# EAGLE design MBUSadapter (EAGLE 7.2.0)
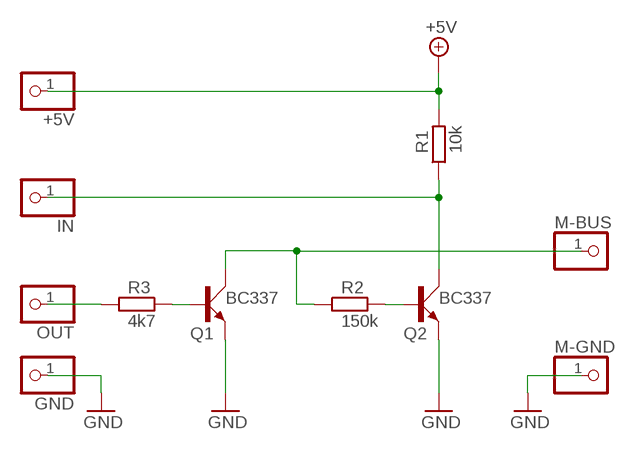
[diagram p0: schematic, sheet 1]

## Parts
+5V  PINHD-1X1  [1X01]
GND  PINHD-1X1  [1X01]
IN  PINHD-1X1  [1X01]
M-BUS  PINHD-1X1  [1X01]
M-GND  PINHD-1X1  [1X01]
OUT  PINHD-1X1  [1X01]
Q1  BC337  [SOT54A]
Q2  BC337  [SOT54A]
R1  10k  R-EU_0207/10  [0207/10]
R2  150k  R-EU_0207/10  [0207/10]
R3  4k7  R-EU_0207/10  [0207/10]

## Nets
+5V: +5V.1 R1.2
GND: GND.1 M-GND.1 Q1.E Q2.E
N$1: IN.1 Q2.C R1.1
N$2: Q1.B R3.1
N$3: OUT.1 R3.2
N$4: M-BUS.1 Q1.C R2.1
N$6: Q2.B R2.2

## Library data of the parts
+5V GND IN M-BUS M-GND OUT = pinhead:PINHD-1X1: PIN HEADER
Q1 Q2 = transistor-small-signal:BC337: NPN TRANSISTOR
R1-R3 = rcl:R-EU_: RESISTOR, European symbol

## Board
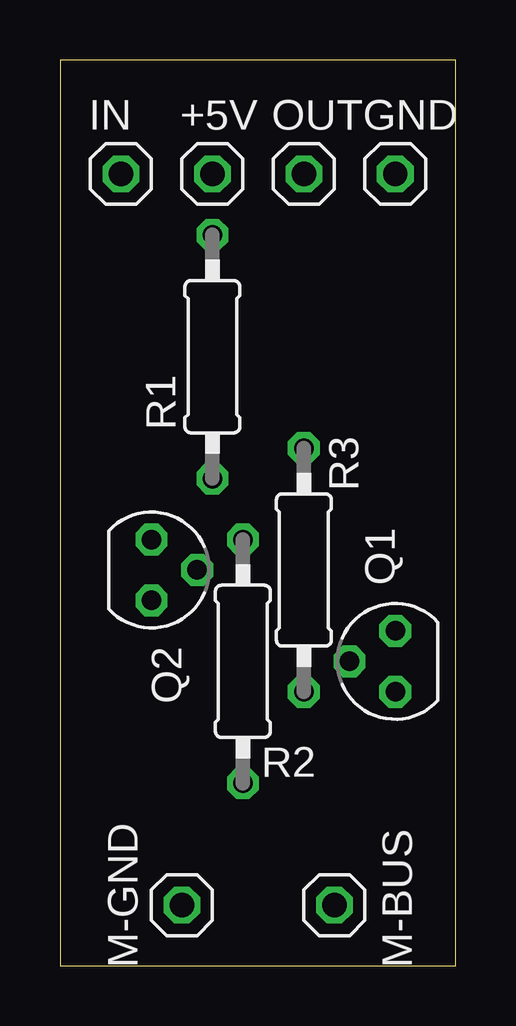
[diagram p1: board, top side]
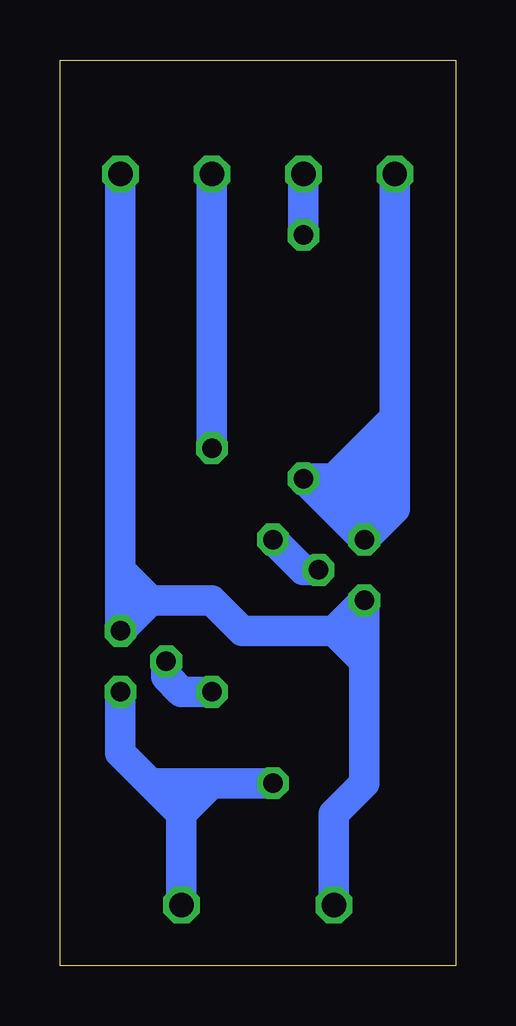
[diagram p2: board, bottom side, seen from below]

Size 16.49 x 37.77 mm. Coordinates in mm from the lower left corner, seen from the top.
Outline: 0,0 16.49,0 16.49,37.77 0,37.77 0,0
Copper layers (1*16): Top 0.035mm / dielectric 1.5mm / Bottom 0.035mm
Design rules "default": minimum track width 10mil, minimum drill 24mil, track to track 8mil, track to pad 8mil, pad to pad 8mil, via to via 8mil, smd to smd 8mil, copper to edge 40mil, drill to drill 8mil, minimum pad ring 10mil, minimum via ring 8mil, stop-mask expansion 4mil, vias tented up to drill 0mil, thermal gap 10mil

### Footprints (pad centres in the part's own frame; a part is rotated, then mirrored left to right if it is on the bottom)
1X01 = drill 1.016 octagon: 1 0,0
SOT54A = drill 0.813 octagon: B 0,1.905; C -1.27,0; E 1.27,0
0207/10 = drill 0.813 octagon: 1 -5.08,0; 2 5.08,0

### Placement (x,y rotation side)
+5V  6.35,33.02 0 top
GND  13.97,33.02 0 top
IN  2.54,33.02 0 top
M-BUS  11.43,2.54 0 top
M-GND  5.08,2.54 0 top
OUT  10.16,33.02 0 top
Q1  13.97,12.7 90 top
Q2  3.81,16.51 270 top
R1  6.35,25.4 90 top
R2  7.62,12.7 90 top
R3  10.16,16.51 90 top

### Tracks (layer width: path | path; a pad name or v marks a point on that pad's centre or on a via)
+5V
  Bottom 1.27: +5V.1 R1.2
GND
  Bottom 1.27: 12.7,15.24 Q1.E 13.97,16.51 | 5.08,13.97 8.89,13.97 10.16,15.24 12.7,15.24 | 5.08,13.97 Q2.E 3.81,12.7 | 3.81,12.7 3.81,7.62 5.08,6.35 M-GND.1 | 13.97,16.51 GND.1 | 12.7,15.24 13.97,16.51 | 5.08,13.97 3.81,12.7
N$1
  Bottom 1.27: 5.08,19.05 Q2.C 2.54,19.05 2.54,20.32 | 5.08,19.05 R1.1 5.08,20.32 2.54,22.86 | IN.1 2.54,22.86 | 2.54,20.32 2.54,21.59 | 2.54,22.86 2.54,21.59 | 2.54,21.59 5.08,19.05 | 5.08,19.05 3.81,19.05 2.54,20.32
N$2
  Bottom 1.27: R3.1 11.43,11.43 12.07,12.07 Q1.B
N$3
  Bottom 1.27: OUT.1 R3.2
N$4
  Bottom 1.27: Q1.C 13.97,8.89 12.7,7.62 | 12.7,7.62 11.43,7.62 | R2.1 10.16,7.62 | 10.16,7.62 11.43,7.62 | 11.43,7.62 11.43,6.35 | 11.43,6.35 M-BUS.1 | 10.16,7.62 11.43,6.35 | 11.43,6.35 12.7,7.62
N$6
  Bottom 1.27: Q2.B 6.35,16.51 R2.2